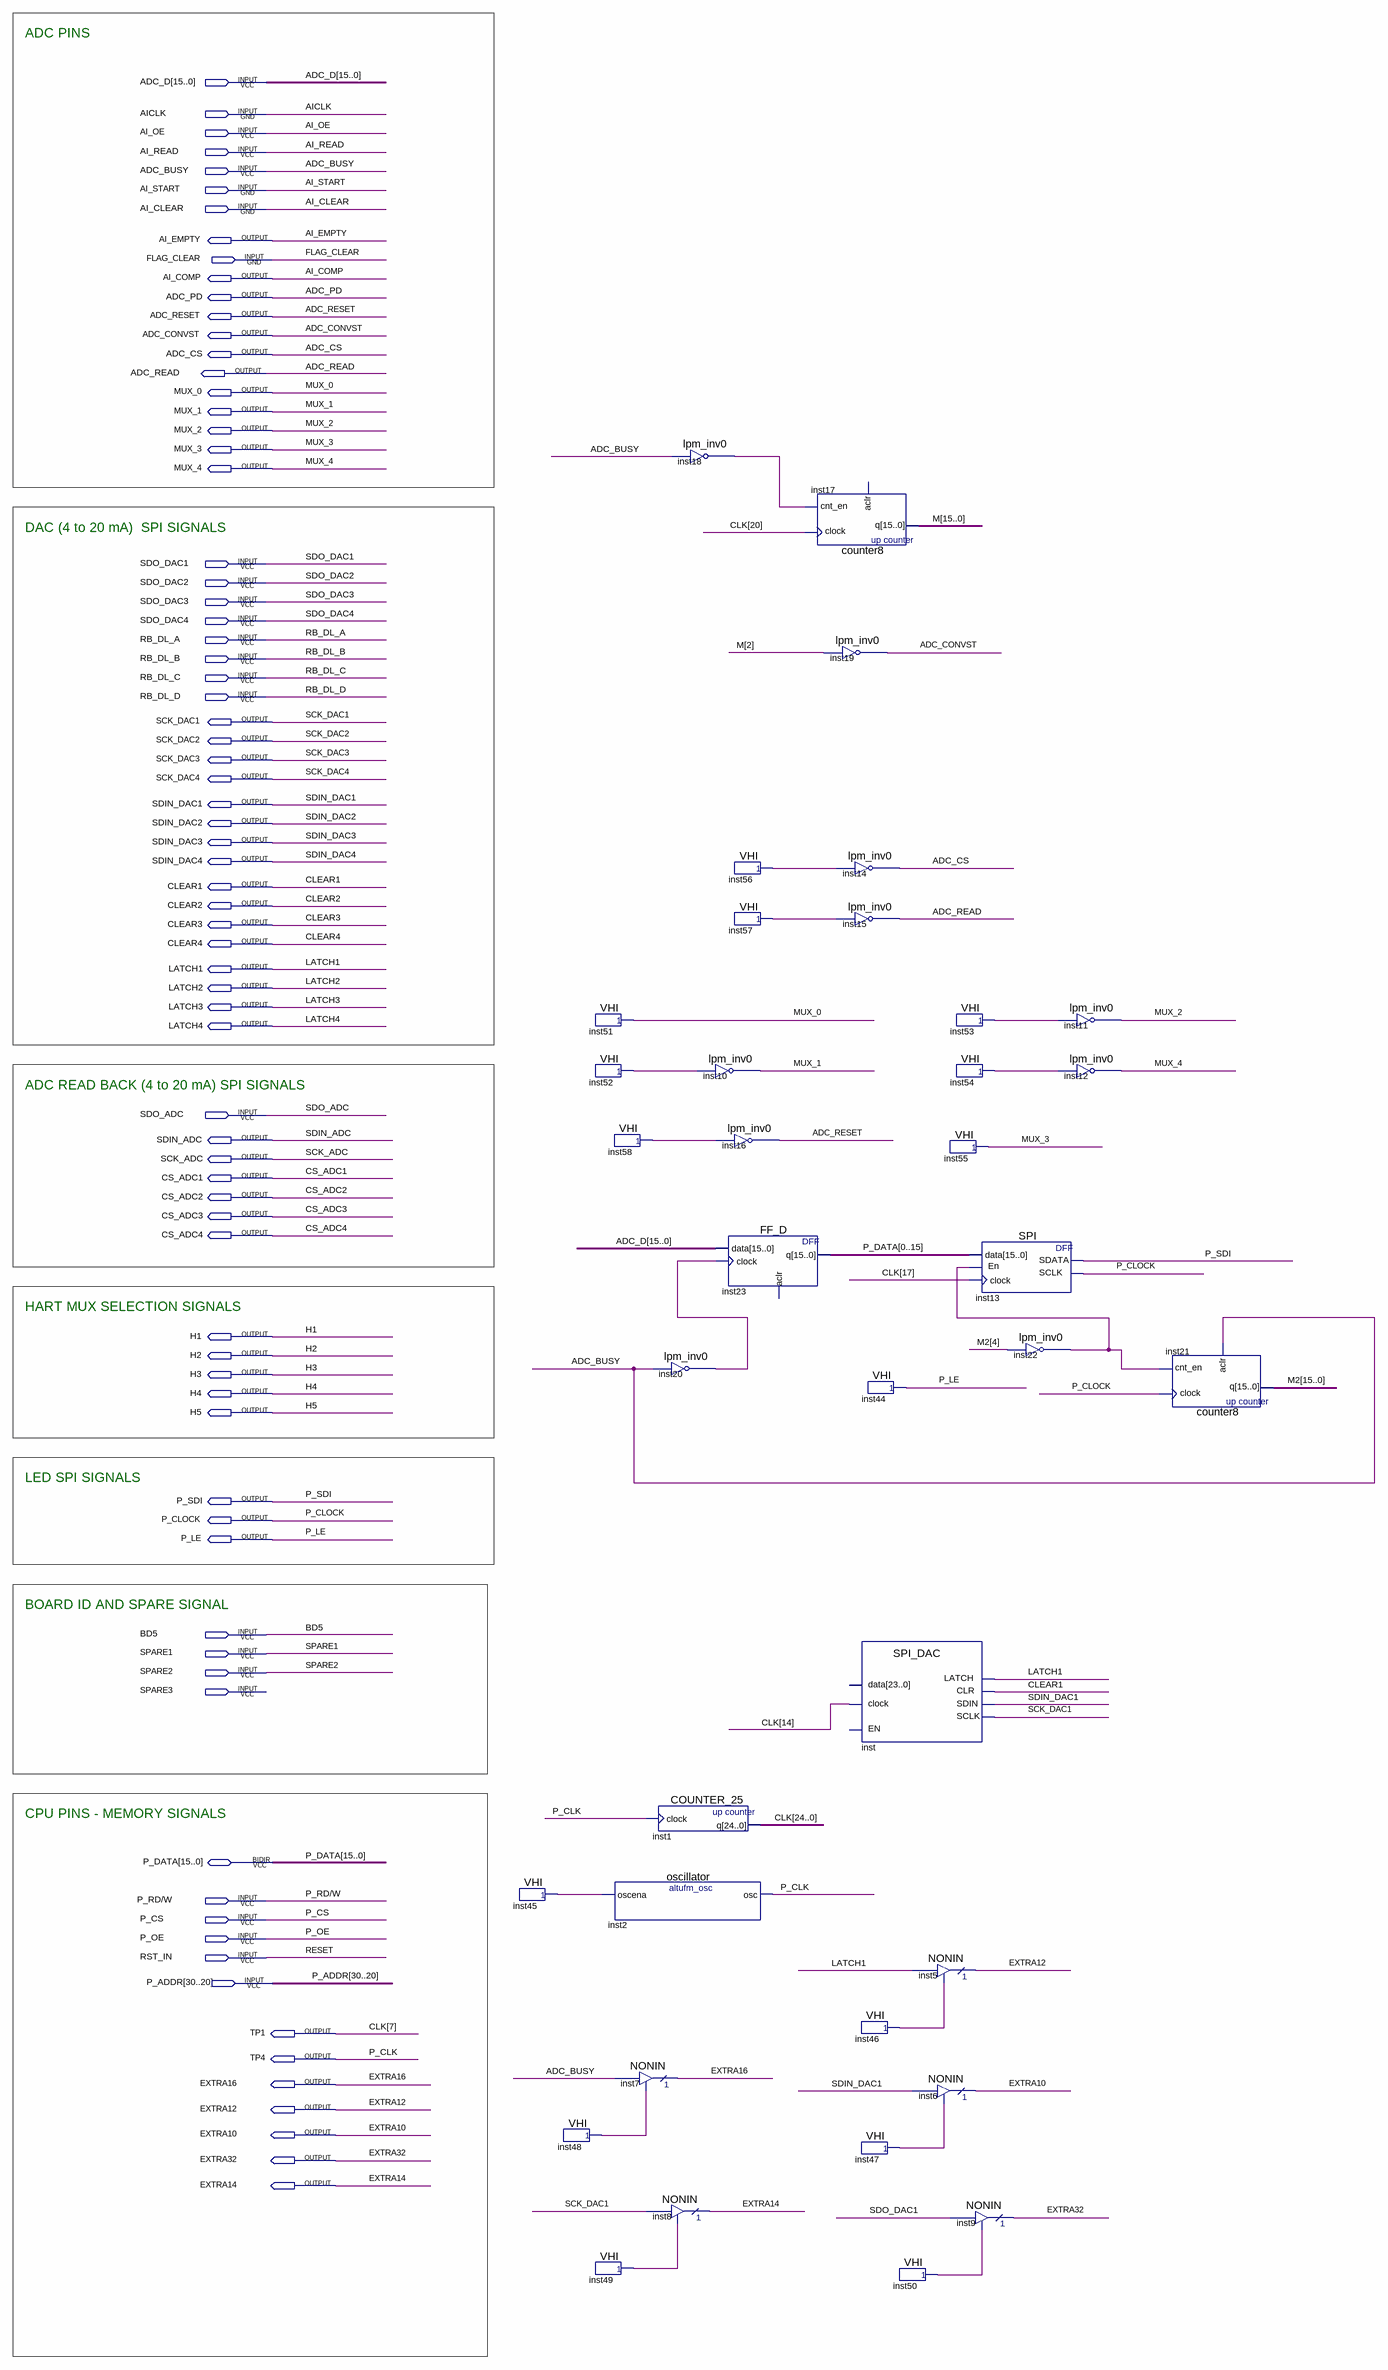
[diagram p0: schematic sheet]
// Quartus schematic IOP.bdf as structural Verilog: 37 symbols, 76 pins
module IOP (
  input  [15:0] ADC_D,
  input  AICLK,
  input  AI_OE,
  input  AI_READ,
  input  ADC_BUSY,
  input  AI_START,
  input  AI_CLEAR,
  input  FLAG_CLEAR,
  input  SDO_DAC1,
  input  SDO_DAC2,
  input  SDO_DAC3,
  input  SDO_DAC4,
  input  RB_DL_A,
  input  RB_DL_B,
  input  RB_DL_C,
  input  RB_DL_D,
  input  SDO_ADC,
  input  BD5,
  input  SPARE1,
  input  SPARE2,
  input  SPARE3,
  input  \P_RD/W ,
  input  P_CS,
  input  P_OE,
  input  RST_IN,
  input  [30:20] P_ADDR,
  inout  [15:0] P_DATA,
  output AI_EMPTY,
  output AI_COMP,
  output ADC_PD,
  output ADC_RESET,
  output ADC_CONVST,
  output ADC_CS,
  output ADC_READ,
  output MUX_0,
  output MUX_1,
  output MUX_2,
  output MUX_3,
  output MUX_4,
  output SCK_DAC1,
  output SCK_DAC2,
  output SCK_DAC3,
  output SCK_DAC4,
  output SDIN_DAC1,
  output SDIN_DAC2,
  output SDIN_DAC3,
  output SDIN_DAC4,
  output CLEAR1,
  output CLEAR2,
  output CLEAR3,
  output CLEAR4,
  output LATCH1,
  output LATCH2,
  output LATCH3,
  output LATCH4,
  output SDIN_ADC,
  output SCK_ADC,
  output CS_ADC1,
  output CS_ADC2,
  output CS_ADC3,
  output CS_ADC4,
  output H1,
  output H2,
  output H3,
  output H4,
  output H5,
  output P_SDI,
  output P_CLOCK,
  output P_LE,
  output TP1,
  output TP4,
  output EXTRA16,
  output EXTRA12,
  output EXTRA10,
  output EXTRA32,
  output EXTRA14
);

  wire inst18_result, inst20_result, inst22_result, inst45_result, inst46_result, inst47_result,
       inst48_result, inst49_result, inst50_result, inst52_result, inst53_result, inst54_result,
       inst56_result, inst57_result, inst58_result;
  wire [15:0] M, M2;
  wire [24:0] CLK;

  VHI inst45 (.result(inst45_result));
  VHI inst48 (.result(inst48_result));
  VHI inst51 (.result(MUX_0));
  VHI inst52 (.result(inst52_result));
  VHI inst58 (.result(inst58_result));
  oscillator inst2 (.oscena(inst45_result), .osc(TP4));
  VHI inst49 (.result(inst49_result));
  lpm_inv0 inst20 (.data(ADC_BUSY), .result(inst20_result));
  COUNTER_25 inst1 (.clock(TP4), .q({CLK[24:8], TP1, CLK[6:0]}));
  NONIN inst7 (.enabledt(inst48_result), .data(ADC_BUSY), .tridata(EXTRA16));
  NONIN inst8 (.enabledt(inst49_result), .data(SCK_DAC1), .tridata(EXTRA14));
  lpm_inv0 inst18 (.data(ADC_BUSY), .result(inst18_result));
  lpm_inv0 inst10 (.data(inst52_result), .result(MUX_1));
  VHI inst56 (.result(inst56_result));
  VHI inst57 (.result(inst57_result));
  lpm_inv0 inst16 (.data(inst58_result), .result(ADC_RESET));
  FF_D inst23 (
    .data(ADC_D), .clock(inst20_result),
    .q({P_DATA[0], P_DATA[1], P_DATA[2], P_DATA[3], P_DATA[4], P_DATA[5], P_DATA[6], P_DATA[7], P_DATA[8], P_DATA[9], P_DATA[10], P_DATA[11], P_DATA[12], P_DATA[13], P_DATA[14], P_DATA[15]}));  // open: aclr
  counter8 inst17 (.clock(CLK[20]), .cnt_en(inst18_result), .q(M));  // open: aclr
  lpm_inv0 inst19 (.data(M[2]), .result(ADC_CONVST));
  lpm_inv0 inst14 (.data(inst56_result), .result(ADC_CS));
  lpm_inv0 inst15 (.data(inst57_result), .result(ADC_READ));
  VHI inst44 (.result(P_LE));
  SPI_DAC inst (.clock(CLK[14]), .LATCH(LATCH1), .SDIN(SDIN_DAC1), .SCLK(SCK_DAC1), .CLR(CLEAR1));  // open: data, EN
  VHI inst46 (.result(inst46_result));
  VHI inst47 (.result(inst47_result));
  NONIN inst5 (.enabledt(inst46_result), .data(LATCH1), .tridata(EXTRA12));
  NONIN inst6 (.enabledt(inst47_result), .data(SDIN_DAC1), .tridata(EXTRA10));
  VHI inst50 (.result(inst50_result));
  VHI inst53 (.result(inst53_result));
  VHI inst54 (.result(inst54_result));
  VHI inst55 (.result(MUX_3));
  NONIN inst9 (.enabledt(inst50_result), .data(SDO_DAC1), .tridata(EXTRA32));
  SPI inst13 (
    .data({P_DATA[0], P_DATA[1], P_DATA[2], P_DATA[3], P_DATA[4], P_DATA[5], P_DATA[6], P_DATA[7], P_DATA[8], P_DATA[9], P_DATA[10], P_DATA[11], P_DATA[12], P_DATA[13], P_DATA[14], P_DATA[15]}),
    .clock(CLK[17]), .En(inst22_result), .SDATA(P_SDI), .SCLK(P_CLOCK));
  lpm_inv0 inst22 (.data(M2[4]), .result(inst22_result));
  lpm_inv0 inst11 (.data(inst53_result), .result(MUX_2));
  lpm_inv0 inst12 (.data(inst54_result), .result(MUX_4));
  counter8 inst21 (.clock(P_CLOCK), .cnt_en(inst22_result), .aclr(ADC_BUSY), .q(M2));

  // Other names for the same wires on the sheet: CLK[7] = TP1; P_CLK = TP4; RESET = RST_IN

  // Notes on the sheet:
  //   ADC PINS
  //   DAC (4 to 20 mA)  SPI SIGNALS
  //   ADC READ BACK (4 to 20 mA) SPI SIGNALS
  //   HART MUX SELECTION SIGNALS
  //   LED SPI SIGNALS
  //   BOARD ID AND SPARE SIGNAL
  //   CPU PINS - MEMORY SIGNALS
endmodule
